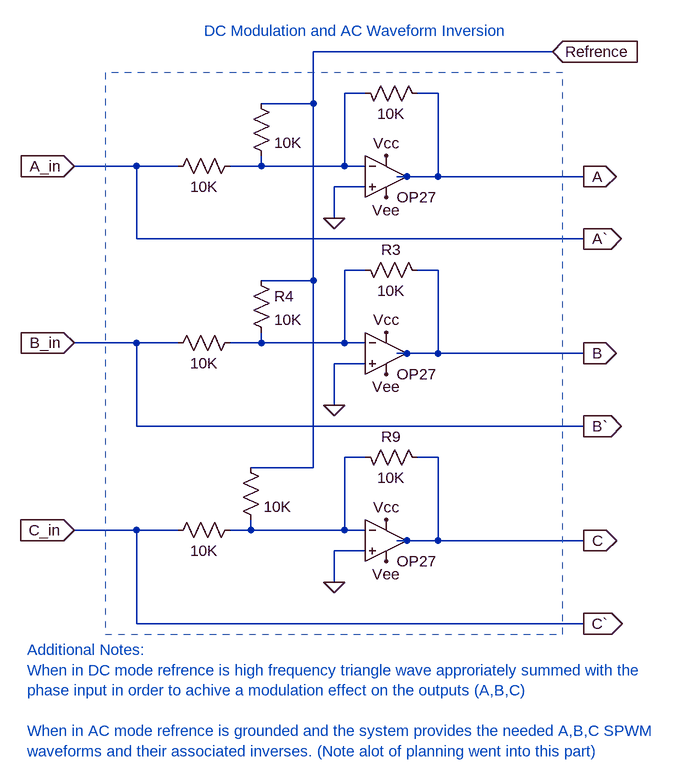
[diagram p0: schematic Modulation_and_Inversion.asc]
Modulation_and_Inversion.asc, the LTspice schematic file:
Version 4
SHEET 1 880 1116
WIRE 240 16 -128 16
WIRE -48 80 -80 80
WIRE 64 80 32 80
WIRE -128 96 -128 16
WIRE -128 96 -208 96
WIRE -400 192 -496 192
WIRE -336 192 -400 192
WIRE -208 192 -208 176
WIRE -208 192 -256 192
WIRE -80 192 -80 80
WIRE -80 192 -208 192
WIRE -48 192 -80 192
WIRE 16 208 0 208
WIRE 64 208 64 80
WIRE 64 208 16 208
WIRE 288 208 64 208
WIRE -48 224 -96 224
WIRE -96 272 -96 224
WIRE -400 304 -400 192
WIRE 288 304 -400 304
WIRE -48 352 -80 352
WIRE 64 352 32 352
WIRE -128 368 -128 96
WIRE -128 368 -208 368
WIRE -400 464 -496 464
WIRE -336 464 -400 464
WIRE -208 464 -208 448
WIRE -208 464 -256 464
WIRE -80 464 -80 352
WIRE -80 464 -208 464
WIRE -48 464 -80 464
WIRE 16 480 0 480
WIRE 64 480 64 352
WIRE 64 480 16 480
WIRE 288 480 64 480
WIRE -48 496 -96 496
WIRE -96 560 -96 496
WIRE -400 592 -400 464
WIRE 288 592 -400 592
WIRE -48 640 -80 640
WIRE 64 640 32 640
WIRE -128 656 -128 368
WIRE -128 656 -224 656
WIRE -400 752 -496 752
WIRE -336 752 -400 752
WIRE -224 752 -224 736
WIRE -224 752 -256 752
WIRE -80 752 -80 640
WIRE -80 752 -224 752
WIRE -48 752 -80 752
WIRE 16 768 0 768
WIRE 64 768 64 640
WIRE 64 768 16 768
WIRE 288 768 64 768
WIRE -48 784 -96 784
WIRE -96 832 -96 784
WIRE -400 896 -400 752
WIRE 288 896 -400 896
FLAG -16 448 Vcc
FLAG -16 512 Vee
FLAG -96 560 0
FLAG -16 176 Vcc
FLAG -16 240 Vee
FLAG -96 272 0
FLAG -16 736 Vcc
FLAG -16 800 Vee
FLAG -96 832 0
FLAG 288 208 A
IOPIN 288 208 Out
FLAG 288 304 A`
IOPIN 288 304 Out
FLAG 288 480 B
IOPIN 288 480 Out
FLAG 288 592 B`
IOPIN 288 592 Out
FLAG 288 768 C
IOPIN 288 768 Out
FLAG 288 896 C`
IOPIN 288 896 Out
FLAG -496 192 A_in
IOPIN -496 192 In
FLAG -496 464 B_in
IOPIN -496 464 In
FLAG -496 752 C_in
IOPIN -496 752 In
FLAG 240 16 Refrence
IOPIN 240 16 In
SYMBOL res -352 768 R270
WINDOW 0 32 56 Invisible 2
WINDOW 3 0 56 VBottom 2
SYMATTR InstName R1
SYMATTR Value 10K
SYMBOL res -240 640 R0
WINDOW 0 36 40 Invisible 2
SYMATTR InstName R2
SYMATTR Value 10K
SYMBOL res 48 368 M270
WINDOW 0 32 56 VTop 2
WINDOW 3 0 56 VBottom 2
SYMATTR InstName R3
SYMATTR Value 10K
SYMBOL res -224 352 R0
SYMATTR InstName R4
SYMATTR Value 10K
SYMBOL Opamps\\OP27 -16 416 R0
WINDOW 0 16 32 Invisible 2
SYMATTR InstName U1
SYMBOL res -240 448 R90
WINDOW 0 0 56 Invisible 2
WINDOW 3 32 56 VTop 2
SYMATTR InstName R5
SYMATTR Value 10K
SYMBOL res 48 96 M270
WINDOW 0 32 56 Invisible 2
WINDOW 3 0 56 VBottom 2
SYMATTR InstName R6
SYMATTR Value 10K
SYMBOL res -224 80 R0
WINDOW 0 36 40 Invisible 2
SYMATTR InstName R7
SYMATTR Value 10K
SYMBOL Opamps\\OP27 -16 144 R0
WINDOW 0 16 32 Invisible 2
SYMATTR InstName U2
SYMBOL res -240 176 R90
WINDOW 0 0 56 Invisible 2
WINDOW 3 32 56 VTop 2
SYMATTR InstName R8
SYMATTR Value 10K
SYMBOL res 48 656 M270
WINDOW 0 32 56 VTop 2
WINDOW 3 0 56 VBottom 2
SYMATTR InstName R9
SYMATTR Value 10K
SYMBOL Opamps\\OP27 -16 704 R0
WINDOW 0 16 32 Invisible 2
SYMATTR InstName U3
TEXT -296 -16 Left 2 ;DC Modulation and AC Waveform Inversion
TEXT -568 936 Left 2 ;Additional Notes:\nWhen in DC mode refrence is high frequency triangle wave approriately summed with the\nphase input in order to achive a modulation effect on the outputs (A,B,C)\n \nWhen in AC mode refrence is grounded and the system provides the needed A,B,C SPWM\nwaveforms and their associated inverses. (Note alot of planning went into this part)
RECTANGLE Normal -448 912 256 48 2

The netlist it stands for:
* Modulation_and_Inversion.asc
R1 C_in N003 10K
R2 Refrence N003 10K
R3 B N002 10K
R4 Refrence N002 10K
XU1 0 N002 Vcc Vee B OP27  ; pins In+ In- V+ V- OUT
R5 N002 B_in 10K
R6 A N001 10K
R7 Refrence N001 10K
XU2 0 N001 Vcc Vee A OP27  ; pins In+ In- V+ V- OUT
R8 N001 A_in 10K
R9 C N003 10K
XU3 0 N003 Vcc Vee C OP27  ; pins In+ In- V+ V- OUT
* DC Modulation and AC Waveform Inversion
* Additional Notes:
* When in DC mode refrence is high frequency triangle wave approriately summed with the
* phase input in order to achive a modulation effect on the outputs (A,B,C)
* When in AC mode refrence is grounded and the system provides the needed A,B,C SPWM
* waveforms and their associated inverses. (Note alot of planning went into this part)
.lib ADI.lib
.backanno
.end